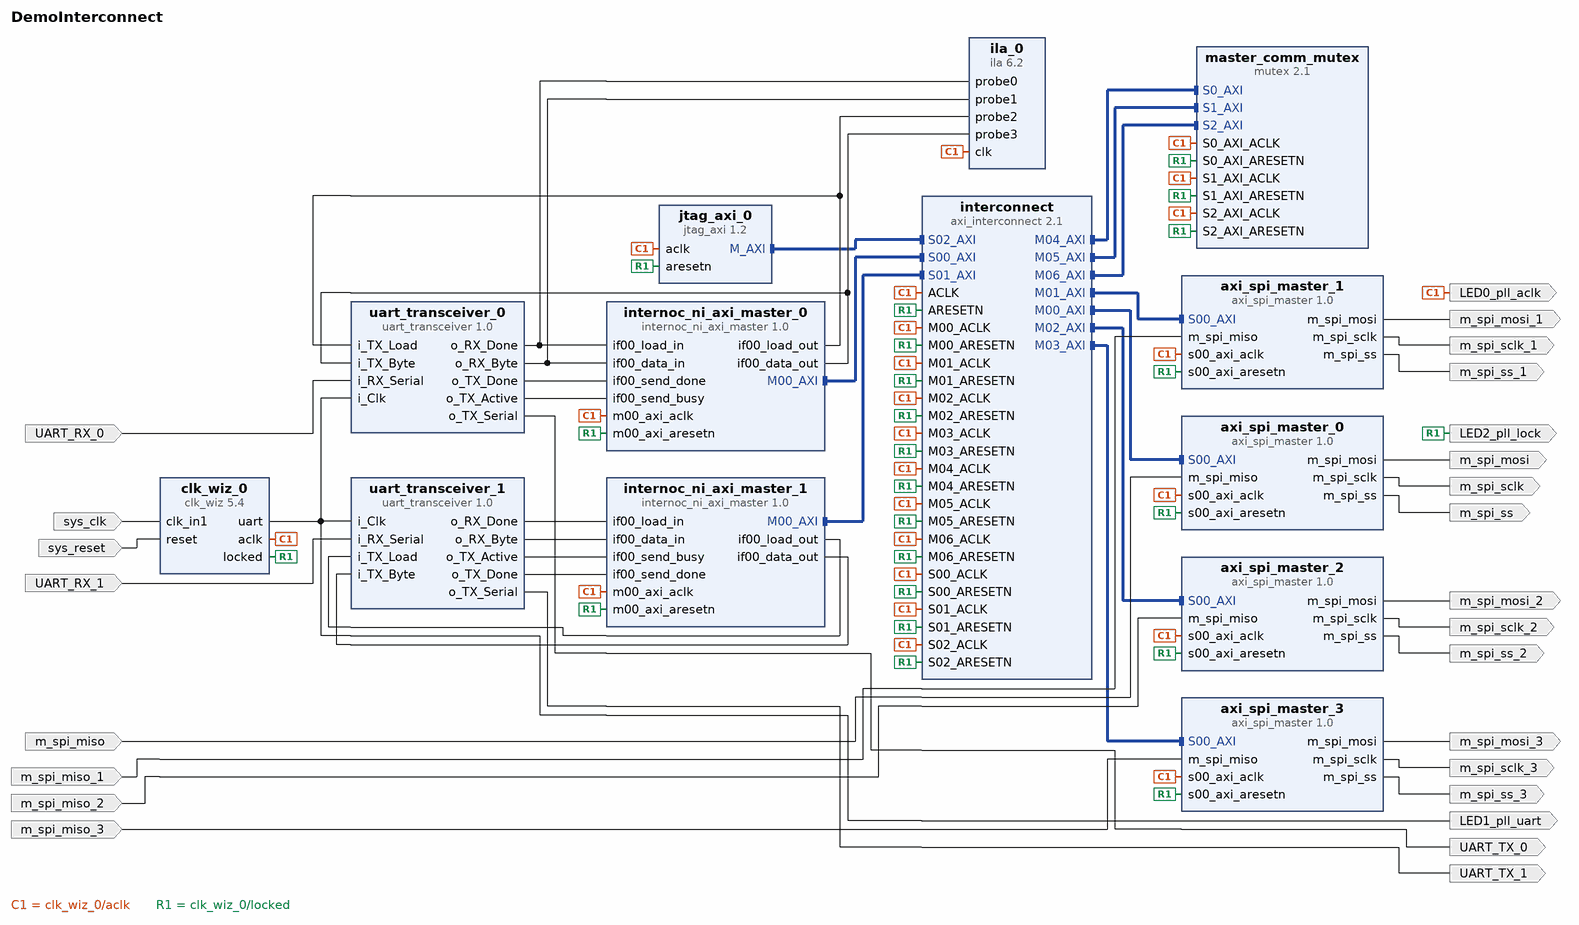
[diagram p0: block diagram of the top level]
# Vivado block design DemoInterconnect, xc7a15tcpg236-1, Vivado 2017.3
create_bd_design DemoInterconnect

create_bd_port -dir O LED0_pll_aclk
create_bd_port -dir O LED2_pll_lock
create_bd_port -dir I -type clk sys_clk
set_property -dict {CONFIG.FREQ_HZ 12000000 CONFIG.ASSOCIATED_RESET sys_reset} [get_bd_ports sys_clk]
create_bd_port -dir O LED1_pll_uart
create_bd_port -dir I -type data UART_RX_0
create_bd_port -dir O UART_TX_0
create_bd_port -dir I -type data UART_RX_1
create_bd_port -dir O -type data UART_TX_1
create_bd_port -dir I -type data m_spi_miso
create_bd_port -dir O -type data m_spi_mosi
create_bd_port -dir O -type ce m_spi_ss
create_bd_port -dir O -type clk m_spi_sclk
create_bd_port -dir I -type data m_spi_miso_1
create_bd_port -dir O -type data m_spi_mosi_1
create_bd_port -dir O -type ce m_spi_ss_1
create_bd_port -dir O -type clk m_spi_sclk_1
create_bd_port -dir I -type data m_spi_miso_2
create_bd_port -dir O -type data m_spi_mosi_2
create_bd_port -dir O -type ce m_spi_ss_2
create_bd_port -dir O -type clk m_spi_sclk_2
create_bd_port -dir I -type data m_spi_miso_3
create_bd_port -dir O -type data m_spi_mosi_3
create_bd_port -dir O -type ce m_spi_ss_3
create_bd_port -dir O -type clk m_spi_sclk_3
create_bd_port -dir I -type rst sys_reset
set_property -dict {CONFIG.POLARITY ACTIVE_HIGH} [get_bd_ports sys_reset]

create_bd_cell -type ip -vlnv xilinx.com:ip:axi_interconnect:2.1 interconnect
set_property -dict [list \
  CONFIG.NUM_SI 3 \
  CONFIG.NUM_MI 7 \
  CONFIG.ENABLE_ADVANCED_OPTIONS 0 \
  CONFIG.SYNCHRONIZATION_STAGES 2 \
  CONFIG.M00_HAS_REGSLICE 3 \
  CONFIG.M01_HAS_REGSLICE 3 \
  CONFIG.M02_HAS_REGSLICE 3 \
  CONFIG.M03_HAS_REGSLICE 3 \
  CONFIG.S00_HAS_REGSLICE 3 \
  CONFIG.S01_HAS_REGSLICE 3 \
  CONFIG.S02_HAS_REGSLICE 3 \
] [get_bd_cells interconnect]
create_bd_cell -type ip -vlnv xilinx.com:ip:clk_wiz:5.4 clk_wiz_0
set_property -dict [list \
  CONFIG.JITTER_SEL Min_O_Jitter \
  CONFIG.PRIM_IN_FREQ 12 \
  CONFIG.CLKIN1_JITTER_PS 833.33 \
  CONFIG.CLKOUT2_USED true \
  CONFIG.CLKOUT3_USED false \
  CONFIG.NUM_OUT_CLKS 2 \
  CONFIG.CLK_OUT1_PORT aclk \
  CONFIG.CLK_OUT2_PORT uart \
  CONFIG.CLK_OUT3_PORT clk_out3 \
  CONFIG.CLKOUT1_REQUESTED_OUT_FREQ 72 \
  CONFIG.CLKOUT2_REQUESTED_OUT_FREQ 12 \
  CONFIG.CLKOUT3_REQUESTED_OUT_FREQ 100.000 \
  CONFIG.CLKOUT1_DRIVES BUFGCE \
  CONFIG.CLKOUT2_DRIVES BUFGCE \
  CONFIG.CLKOUT3_DRIVES BUFGCE \
  CONFIG.CLKOUT4_DRIVES BUFGCE \
  CONFIG.CLKOUT5_DRIVES BUFGCE \
  CONFIG.CLKOUT6_DRIVES BUFGCE \
  CONFIG.CLKOUT7_DRIVES BUFGCE \
  CONFIG.FEEDBACK_SOURCE FDBK_AUTO \
  CONFIG.RESET_PORT reset \
  CONFIG.MMCM_DIVCLK_DIVIDE 1 \
  CONFIG.MMCM_BANDWIDTH HIGH \
  CONFIG.MMCM_CLKFBOUT_MULT_F 63.000 \
  CONFIG.MMCM_CLKIN1_PERIOD 83.333 \
  CONFIG.MMCM_CLKIN2_PERIOD 10.0 \
  CONFIG.MMCM_CLKOUT0_DIVIDE_F 10.500 \
  CONFIG.MMCM_CLKOUT1_DIVIDE 63 \
  CONFIG.MMCM_CLKOUT2_DIVIDE 1 \
  CONFIG.RESET_TYPE ACTIVE_HIGH \
  CONFIG.USE_SAFE_CLOCK_STARTUP true \
  CONFIG.CLKOUT1_JITTER 499.161 \
  CONFIG.CLKOUT1_PHASE_ERROR 686.541 \
  CONFIG.CLKOUT2_JITTER 680.336 \
  CONFIG.CLKOUT2_PHASE_ERROR 686.541 \
  CONFIG.CLKOUT3_JITTER 209.588 \
  CONFIG.CLKOUT3_PHASE_ERROR 98.575 \
] [get_bd_cells clk_wiz_0]
create_bd_cell -type ip -vlnv xilinx.com:ip:jtag_axi:1.2 jtag_axi_0
create_bd_cell -type ip -vlnv xilinx.com:ip:mutex:2.1 master_comm_mutex
set_property -dict [list \
  CONFIG.C_ASYNC_CLKS 0 \
  CONFIG.C_NUM_AXI 3 \
  CONFIG.C_ENABLE_USER 1 \
  CONFIG.C_ENABLE_HW_PROT 1 \
] [get_bd_cells master_comm_mutex]
create_bd_cell -type ip -vlnv ekyr:user:uart_transceiver:1.0 uart_transceiver_0
set_property -dict {CONFIG.CLK_FREQ 12000000} [get_bd_cells uart_transceiver_0]
create_bd_cell -type ip -vlnv ekyr:user:uart_transceiver:1.0 uart_transceiver_1
set_property -dict {CONFIG.CLK_FREQ 12000000} [get_bd_cells uart_transceiver_1]
create_bd_cell -type ip -vlnv ekyr.kth.se:user:axi_spi_master:1.0 axi_spi_master_0
set_property -dict {CONFIG.SPI_CLK_DIV 6} [get_bd_cells axi_spi_master_0]
create_bd_cell -type ip -vlnv ekyr.kth.se:user:axi_spi_master:1.0 axi_spi_master_1
set_property -dict {CONFIG.SPI_CLK_DIV 6} [get_bd_cells axi_spi_master_1]
create_bd_cell -type ip -vlnv ekyr.kth.se:user:axi_spi_master:1.0 axi_spi_master_2
set_property -dict {CONFIG.SPI_CLK_DIV 6} [get_bd_cells axi_spi_master_2]
create_bd_cell -type ip -vlnv ekyr.kth.se:user:axi_spi_master:1.0 axi_spi_master_3
set_property -dict {CONFIG.SPI_CLK_DIV 6} [get_bd_cells axi_spi_master_3]
create_bd_cell -type ip -vlnv xilinx.com:ip:ila:6.2 ila_0
set_property -dict [list \
  CONFIG.C_PROBE7_TYPE 1 \
  CONFIG.C_PROBE6_TYPE 0 \
  CONFIG.C_PROBE5_TYPE 1 \
  CONFIG.C_PROBE4_TYPE 0 \
  CONFIG.C_PROBE3_TYPE 1 \
  CONFIG.C_PROBE2_TYPE 0 \
  CONFIG.C_PROBE1_TYPE 1 \
  CONFIG.C_PROBE0_TYPE 0 \
  CONFIG.C_PROBE7_WIDTH 1 \
  CONFIG.C_PROBE5_WIDTH 1 \
  CONFIG.C_PROBE3_WIDTH 8 \
  CONFIG.C_PROBE1_WIDTH 8 \
  CONFIG.C_DATA_DEPTH 8192 \
  CONFIG.C_NUM_OF_PROBES 4 \
  CONFIG.C_EN_STRG_QUAL 1 \
  CONFIG.C_ADV_TRIGGER false \
  CONFIG.C_PROBE7_MU_CNT 2 \
  CONFIG.C_PROBE6_MU_CNT 2 \
  CONFIG.C_PROBE5_MU_CNT 2 \
  CONFIG.C_PROBE4_MU_CNT 2 \
  CONFIG.C_PROBE3_MU_CNT 2 \
  CONFIG.C_PROBE2_MU_CNT 2 \
  CONFIG.C_PROBE1_MU_CNT 2 \
  CONFIG.C_PROBE0_MU_CNT 2 \
  CONFIG.ALL_PROBE_SAME_MU_CNT 2 \
  CONFIG.C_ENABLE_ILA_AXI_MON false \
  CONFIG.C_MONITOR_TYPE Native \
] [get_bd_cells ila_0]
create_bd_cell -type ip -vlnv e.kyriakakis:user:internoc_ni_axi_master:1.0 internoc_ni_axi_master_0
set_property -dict {CONFIG.C_M00_SELF_ADDR 16 CONFIG.C_TIMEOUT_PERIOD 16383} [get_bd_cells internoc_ni_axi_master_0]
create_bd_cell -type ip -vlnv e.kyriakakis:user:internoc_ni_axi_master:1.0 internoc_ni_axi_master_1
set_property -dict {CONFIG.C_M00_SELF_ADDR 16 CONFIG.C_TIMEOUT_PERIOD 16383} [get_bd_cells internoc_ni_axi_master_1]

# ---- connections ----

connect_bd_intf_net [get_bd_intf_pins jtag_axi_0/M_AXI] [get_bd_intf_pins interconnect/S02_AXI]
connect_bd_intf_net -intf_net axi_interconnect_0_M00_AXI [get_bd_intf_pins interconnect/M00_AXI] [get_bd_intf_pins axi_spi_master_0/S00_AXI]
connect_bd_intf_net -intf_net axi_interconnect_0_M01_AXI [get_bd_intf_pins axi_spi_master_1/S00_AXI] [get_bd_intf_pins interconnect/M01_AXI]
connect_bd_intf_net -intf_net axi_interconnect_0_M02_AXI [get_bd_intf_pins axi_spi_master_2/S00_AXI] [get_bd_intf_pins interconnect/M02_AXI]
connect_bd_intf_net -intf_net axi_interconnect_0_M03_AXI [get_bd_intf_pins axi_spi_master_3/S00_AXI] [get_bd_intf_pins interconnect/M03_AXI]
connect_bd_intf_net -intf_net axi_interconnect_0_M04_AXI [get_bd_intf_pins interconnect/M04_AXI] [get_bd_intf_pins master_comm_mutex/S0_AXI]
connect_bd_intf_net -intf_net axi_interconnect_0_M05_AXI [get_bd_intf_pins interconnect/M05_AXI] [get_bd_intf_pins master_comm_mutex/S1_AXI]
connect_bd_intf_net -intf_net axi_interconnect_0_M06_AXI [get_bd_intf_pins interconnect/M06_AXI] [get_bd_intf_pins master_comm_mutex/S2_AXI]
connect_bd_intf_net [get_bd_intf_pins internoc_ni_axi_master_0/M00_AXI] [get_bd_intf_pins interconnect/S00_AXI]
connect_bd_intf_net [get_bd_intf_pins internoc_ni_axi_master_1/M00_AXI] [get_bd_intf_pins interconnect/S01_AXI]
connect_bd_net -net clk_wiz_0_clk_out1 [get_bd_pins clk_wiz_0/aclk] \
  [get_bd_ports LED0_pll_aclk] [get_bd_pins jtag_axi_0/aclk] [get_bd_pins master_comm_mutex/S0_AXI_ACLK] \
  [get_bd_pins master_comm_mutex/S1_AXI_ACLK] [get_bd_pins master_comm_mutex/S2_AXI_ACLK] \
  [get_bd_pins axi_spi_master_0/s00_axi_aclk] [get_bd_pins axi_spi_master_1/s00_axi_aclk] \
  [get_bd_pins axi_spi_master_2/s00_axi_aclk] [get_bd_pins axi_spi_master_3/s00_axi_aclk] [get_bd_pins ila_0/clk] \
  [get_bd_pins interconnect/ACLK] [get_bd_pins interconnect/S00_ACLK] [get_bd_pins interconnect/S01_ACLK] \
  [get_bd_pins interconnect/S02_ACLK] [get_bd_pins interconnect/M00_ACLK] [get_bd_pins interconnect/M01_ACLK] \
  [get_bd_pins interconnect/M02_ACLK] [get_bd_pins interconnect/M03_ACLK] [get_bd_pins interconnect/M04_ACLK] \
  [get_bd_pins interconnect/M05_ACLK] [get_bd_pins interconnect/M06_ACLK] [get_bd_pins internoc_ni_axi_master_0/m00_axi_aclk] \
  [get_bd_pins internoc_ni_axi_master_1/m00_axi_aclk]
connect_bd_net [get_bd_pins clk_wiz_0/locked] \
  [get_bd_ports LED2_pll_lock] [get_bd_pins jtag_axi_0/aresetn] [get_bd_pins master_comm_mutex/S0_AXI_ARESETN] \
  [get_bd_pins master_comm_mutex/S1_AXI_ARESETN] [get_bd_pins master_comm_mutex/S2_AXI_ARESETN] \
  [get_bd_pins axi_spi_master_0/s00_axi_aresetn] [get_bd_pins axi_spi_master_1/s00_axi_aresetn] \
  [get_bd_pins axi_spi_master_2/s00_axi_aresetn] [get_bd_pins axi_spi_master_3/s00_axi_aresetn] \
  [get_bd_pins interconnect/ARESETN] [get_bd_pins interconnect/S00_ARESETN] [get_bd_pins interconnect/S01_ARESETN] \
  [get_bd_pins interconnect/S02_ARESETN] [get_bd_pins interconnect/M00_ARESETN] [get_bd_pins interconnect/M01_ARESETN] \
  [get_bd_pins interconnect/M02_ARESETN] [get_bd_pins interconnect/M03_ARESETN] [get_bd_pins interconnect/M04_ARESETN] \
  [get_bd_pins interconnect/M05_ARESETN] [get_bd_pins interconnect/M06_ARESETN] \
  [get_bd_pins internoc_ni_axi_master_0/m00_axi_aresetn] [get_bd_pins internoc_ni_axi_master_1/m00_axi_aresetn]
connect_bd_net [get_bd_ports sys_clk] [get_bd_pins clk_wiz_0/clk_in1]
connect_bd_net [get_bd_pins clk_wiz_0/uart] [get_bd_ports LED1_pll_uart] [get_bd_pins uart_transceiver_0/i_Clk] [get_bd_pins uart_transceiver_1/i_Clk]
connect_bd_net [get_bd_pins uart_transceiver_0/o_RX_Done] [get_bd_pins ila_0/probe0] [get_bd_pins internoc_ni_axi_master_0/if00_load_in]
connect_bd_net [get_bd_pins uart_transceiver_0/o_RX_Byte] [get_bd_pins ila_0/probe1] [get_bd_pins internoc_ni_axi_master_0/if00_data_in]
connect_bd_net -net interface_axi_master_0_if00_load_out [get_bd_pins internoc_ni_axi_master_0/if00_load_out] \
  [get_bd_pins uart_transceiver_0/i_TX_Load] [get_bd_pins ila_0/probe2]
connect_bd_net -net interface_axi_master_0_if00_data_out [get_bd_pins internoc_ni_axi_master_0/if00_data_out] \
  [get_bd_pins uart_transceiver_0/i_TX_Byte] [get_bd_pins ila_0/probe3]
connect_bd_net -net UART_RX_0_1 [get_bd_ports UART_RX_0] [get_bd_pins uart_transceiver_0/i_RX_Serial]
connect_bd_net [get_bd_pins uart_transceiver_0/o_TX_Serial] [get_bd_ports UART_TX_0]
connect_bd_net -net UART_RX_1_1 [get_bd_ports UART_RX_1] [get_bd_pins uart_transceiver_1/i_RX_Serial]
connect_bd_net [get_bd_pins uart_transceiver_1/o_TX_Serial] [get_bd_ports UART_TX_1]
connect_bd_net [get_bd_ports m_spi_miso] [get_bd_pins axi_spi_master_0/m_spi_miso]
connect_bd_net [get_bd_pins axi_spi_master_0/m_spi_mosi] [get_bd_ports m_spi_mosi]
connect_bd_net [get_bd_pins axi_spi_master_0/m_spi_ss] [get_bd_ports m_spi_ss]
connect_bd_net [get_bd_pins axi_spi_master_0/m_spi_sclk] [get_bd_ports m_spi_sclk]
connect_bd_net -net m_spi_miso_1_1 [get_bd_ports m_spi_miso_1] [get_bd_pins axi_spi_master_1/m_spi_miso]
connect_bd_net [get_bd_pins axi_spi_master_1/m_spi_mosi] [get_bd_ports m_spi_mosi_1]
connect_bd_net [get_bd_pins axi_spi_master_1/m_spi_ss] [get_bd_ports m_spi_ss_1]
connect_bd_net [get_bd_pins axi_spi_master_1/m_spi_sclk] [get_bd_ports m_spi_sclk_1]
connect_bd_net -net m_spi_miso_2_1 [get_bd_ports m_spi_miso_2] [get_bd_pins axi_spi_master_2/m_spi_miso]
connect_bd_net [get_bd_pins axi_spi_master_2/m_spi_mosi] [get_bd_ports m_spi_mosi_2]
connect_bd_net [get_bd_pins axi_spi_master_2/m_spi_ss] [get_bd_ports m_spi_ss_2]
connect_bd_net [get_bd_pins axi_spi_master_2/m_spi_sclk] [get_bd_ports m_spi_sclk_2]
connect_bd_net -net m_spi_miso_3_1 [get_bd_ports m_spi_miso_3] [get_bd_pins axi_spi_master_3/m_spi_miso]
connect_bd_net [get_bd_pins axi_spi_master_3/m_spi_mosi] [get_bd_ports m_spi_mosi_3]
connect_bd_net [get_bd_pins axi_spi_master_3/m_spi_ss] [get_bd_ports m_spi_ss_3]
connect_bd_net [get_bd_pins axi_spi_master_3/m_spi_sclk] [get_bd_ports m_spi_sclk_3]
connect_bd_net [get_bd_ports sys_reset] [get_bd_pins clk_wiz_0/reset]
connect_bd_net [get_bd_pins uart_transceiver_0/o_TX_Done] [get_bd_pins internoc_ni_axi_master_0/if00_send_done]
connect_bd_net [get_bd_pins uart_transceiver_0/o_TX_Active] [get_bd_pins internoc_ni_axi_master_0/if00_send_busy]
connect_bd_net [get_bd_pins uart_transceiver_1/o_RX_Done] [get_bd_pins internoc_ni_axi_master_1/if00_load_in]
connect_bd_net [get_bd_pins uart_transceiver_1/o_RX_Byte] [get_bd_pins internoc_ni_axi_master_1/if00_data_in]
connect_bd_net [get_bd_pins uart_transceiver_1/o_TX_Active] [get_bd_pins internoc_ni_axi_master_1/if00_send_busy]
connect_bd_net [get_bd_pins uart_transceiver_1/o_TX_Done] [get_bd_pins internoc_ni_axi_master_1/if00_send_done]
connect_bd_net [get_bd_pins internoc_ni_axi_master_1/if00_load_out] [get_bd_pins uart_transceiver_1/i_TX_Load]
connect_bd_net [get_bd_pins internoc_ni_axi_master_1/if00_data_out] [get_bd_pins uart_transceiver_1/i_TX_Byte]

# ---- address map ----
assign_bd_address -offset 0x00000000 -range 4K -target_address_space [get_bd_addr_spaces internoc_ni_axi_master_0/M00_AXI] [get_bd_addr_segs axi_spi_master_0/S00_AXI/S00_AXI_reg]
assign_bd_address -offset 0x00010000 -range 4K -target_address_space [get_bd_addr_spaces internoc_ni_axi_master_0/M00_AXI] [get_bd_addr_segs axi_spi_master_1/S00_AXI/S00_AXI_reg]
assign_bd_address -offset 0x00020000 -range 4K -target_address_space [get_bd_addr_spaces internoc_ni_axi_master_0/M00_AXI] [get_bd_addr_segs axi_spi_master_2/S00_AXI/S00_AXI_reg]
assign_bd_address -offset 0x00030000 -range 4K -target_address_space [get_bd_addr_spaces internoc_ni_axi_master_0/M00_AXI] [get_bd_addr_segs axi_spi_master_3/S00_AXI/S00_AXI_reg]
assign_bd_address -offset 0x00100000 -range 64K -target_address_space [get_bd_addr_spaces internoc_ni_axi_master_0/M00_AXI] [get_bd_addr_segs master_comm_mutex/S0_AXI/Reg]
assign_bd_address -offset 0x00200000 -range 64K -target_address_space [get_bd_addr_spaces internoc_ni_axi_master_0/M00_AXI] [get_bd_addr_segs master_comm_mutex/S1_AXI/S1_AXI_Reg]
assign_bd_address -offset 0x00300000 -range 64K -target_address_space [get_bd_addr_spaces internoc_ni_axi_master_0/M00_AXI] [get_bd_addr_segs master_comm_mutex/S2_AXI/S2_AXI_Reg]
assign_bd_address -offset 0x00000000 -range 4K -target_address_space [get_bd_addr_spaces internoc_ni_axi_master_1/M00_AXI] [get_bd_addr_segs axi_spi_master_0/S00_AXI/S00_AXI_reg]
assign_bd_address -offset 0x00010000 -range 4K -target_address_space [get_bd_addr_spaces internoc_ni_axi_master_1/M00_AXI] [get_bd_addr_segs axi_spi_master_1/S00_AXI/S00_AXI_reg]
assign_bd_address -offset 0x00020000 -range 4K -target_address_space [get_bd_addr_spaces internoc_ni_axi_master_1/M00_AXI] [get_bd_addr_segs axi_spi_master_2/S00_AXI/S00_AXI_reg]
assign_bd_address -offset 0x00030000 -range 4K -target_address_space [get_bd_addr_spaces internoc_ni_axi_master_1/M00_AXI] [get_bd_addr_segs axi_spi_master_3/S00_AXI/S00_AXI_reg]
assign_bd_address -offset 0x00100000 -range 64K -target_address_space [get_bd_addr_spaces internoc_ni_axi_master_1/M00_AXI] [get_bd_addr_segs master_comm_mutex/S0_AXI/Reg]
assign_bd_address -offset 0x00200000 -range 64K -target_address_space [get_bd_addr_spaces internoc_ni_axi_master_1/M00_AXI] [get_bd_addr_segs master_comm_mutex/S1_AXI/S1_AXI_Reg]
assign_bd_address -offset 0x00300000 -range 64K -target_address_space [get_bd_addr_spaces internoc_ni_axi_master_1/M00_AXI] [get_bd_addr_segs master_comm_mutex/S2_AXI/S2_AXI_Reg]
assign_bd_address -offset 0x00000000 -range 4K -target_address_space [get_bd_addr_spaces jtag_axi_0/Data] [get_bd_addr_segs axi_spi_master_0/S00_AXI/S00_AXI_reg]
assign_bd_address -offset 0x00010000 -range 4K -target_address_space [get_bd_addr_spaces jtag_axi_0/Data] [get_bd_addr_segs axi_spi_master_1/S00_AXI/S00_AXI_reg]
assign_bd_address -offset 0x00020000 -range 4K -target_address_space [get_bd_addr_spaces jtag_axi_0/Data] [get_bd_addr_segs axi_spi_master_2/S00_AXI/S00_AXI_reg]
assign_bd_address -offset 0x00030000 -range 4K -target_address_space [get_bd_addr_spaces jtag_axi_0/Data] [get_bd_addr_segs axi_spi_master_3/S00_AXI/S00_AXI_reg]
assign_bd_address -offset 0x00100000 -range 64K -target_address_space [get_bd_addr_spaces jtag_axi_0/Data] [get_bd_addr_segs master_comm_mutex/S0_AXI/Reg]
assign_bd_address -offset 0x00200000 -range 64K -target_address_space [get_bd_addr_spaces jtag_axi_0/Data] [get_bd_addr_segs master_comm_mutex/S1_AXI/S1_AXI_Reg]
assign_bd_address -offset 0x00300000 -range 64K -target_address_space [get_bd_addr_spaces jtag_axi_0/Data] [get_bd_addr_segs master_comm_mutex/S2_AXI/S2_AXI_Reg]

validate_bd_design
save_bd_design
